# EAGLE design 09F-01 (EAGLE 6.3)
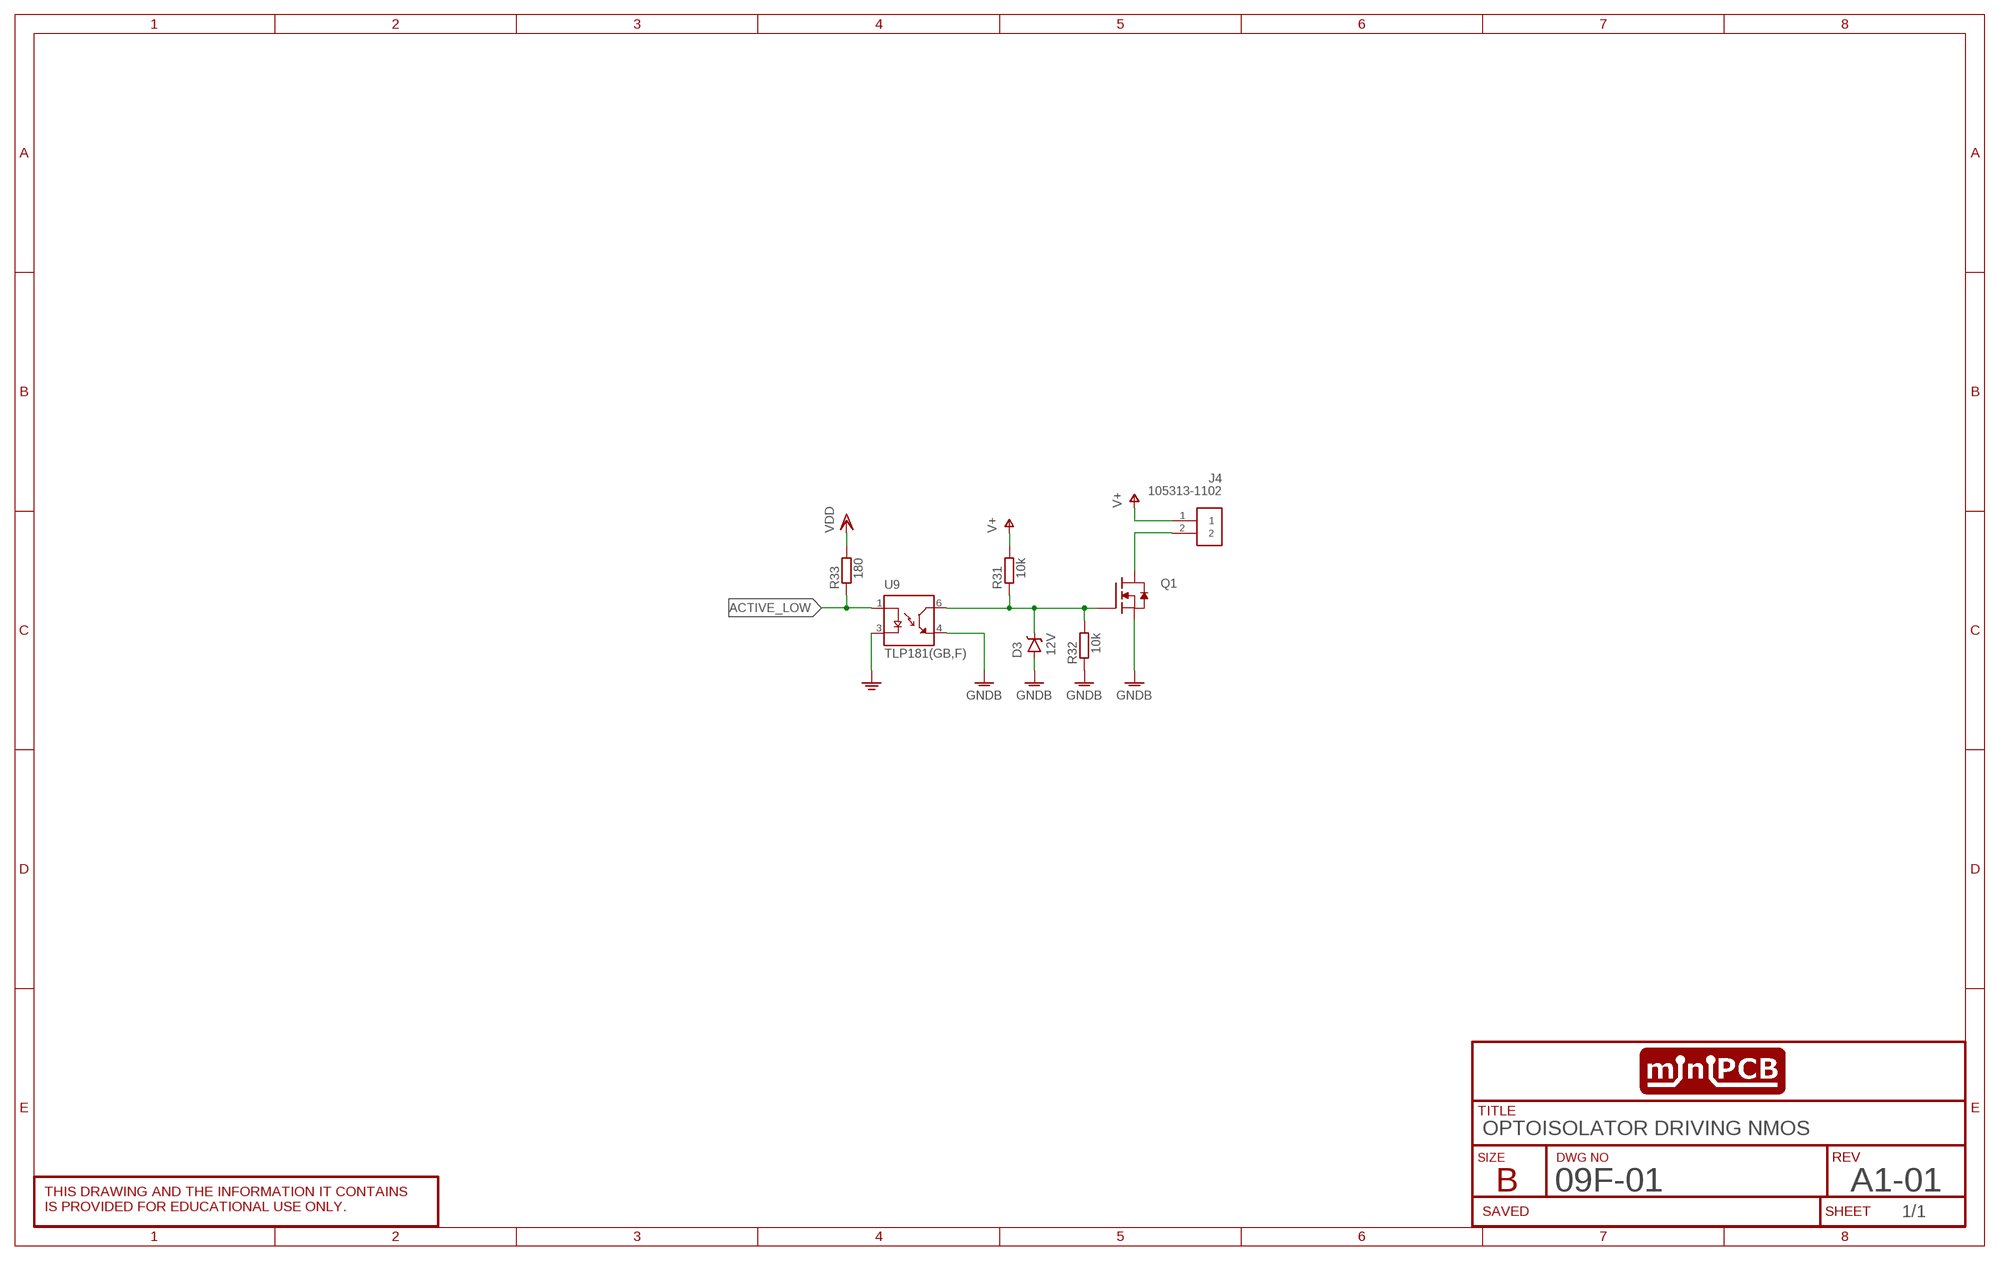
[diagram p0: schematic, sheet 1]
SHEET1 (SCHEMATIC): DWG_NO: 09F-01; REV: A1-01; TITLE: OPTOISOLATOR DRIVING NMOS

## Parts
D3  12V  ZENERSOT23  [SOT23]
J4  105313-1102  PINS_2-NANOFIT-105313-1102  [PINS_2-NANOFIT-H]
Q1  MOSFET-NDPAK  [DPACK]
R31  10k  RESISTORSMD  [R0805]
R32  10k  RESISTORSMD  [R0805]
R33  180  RESISTORSMD  [R0805]
U9  TLP181(GB,F)  [SOIC254P700X280-4N]

## Nets
ACTIVE_LOW: R33.1 U9.1(A)
GND: U9.3(C)
GNDB: D3.1(A) Q1.3(S) R32.1 U9.4(ET)
N$29: D3.3(C) Q1.1(G) R31.1 R32.2 U9.6(CT)
N$31: J4.2 Q1.4(D)
V+: J4.1 R31.2
VDD: R33.2

## Library data of the parts
D3 = minipcb:ZENER: Z-Diode
J4 = utsa:PINS_2
Q1 = minipcb:MOSFET-N
R31-R33 = minipcb:RESISTOR
U9 = minipcb:TLP181(GB,F): Check availability <https://pricing.snapeda.com/parts/TLP181%28GB%2CF%29/Toshiba/view-part?ref=eda>; AVAILABILITY: In Stock; CHECK_PRICES: https://www.snapeda.com/parts/TLP181(GB,F)/Toshiba/view-part/?ref=eda; DESCRIPTION: Optocouplers/Optoisolators, trans, Optoelectronics, optocoupler; MF: Toshiba; MP: TLP181(GB,F); PACKAGE: SO-4 Toshiba; PRICE: None; SNAPEDA_LINK: https://www.snapeda.com/parts/TLP181(GB,F)/Toshiba/view-part/?ref=snap

## Board
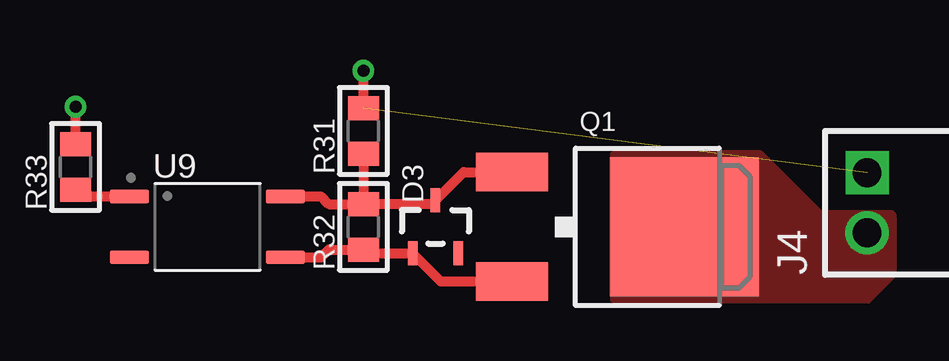
[diagram p1: board, top side]

No outline drawn. Coordinates in mm, seen from the top.
Copper layers (1*16): Top 0.035mm / dielectric 1.5mm / Bottom 0.035mm
Design rules "default": minimum track width 10mil, minimum drill 0.6mm, track to track 8mil, track to pad 8mil, pad to pad 8mil, via to via 8mil, smd to smd 8mil, copper to edge 40mil, drill to drill 8mil, minimum pad ring 10mil, minimum via ring 8mil, stop-mask expansion 4mil, vias tented up to drill 0mil, thermal gap 10mil

### Footprints (pad centres in the part's own frame; a part is rotated, then mirrored left to right if it is on the bottom)
SOT23 = smd 0.4 x 1: 1 -0.95,-1.1; 2 0.95,-1.1; 3 0,1.1
PINS_2-NANOFIT-H = drill 1.2 square: 1 -1.25,0 | drill 1.2: 2 1.25,0 | hole 1.6: 1.27,7.18 | hole 1.75: -1.27,7.18
DPACK = smd 1.6 x 3: 1 -2.28,-4.8; 3 2.28,-4.8 | smd 5.8 x 6.2: 4 0,2.38
R0805 = smd 1 x 1.3: 1 -0.95,0; 2 0.95,0
SOIC254P700X280-4N = smd 1.61 x 0.57: 1 -3.25,1.27; 3 -3.25,-1.27; 4 3.25,-1.27; 6 3.25,1.27

### Placement (x,y rotation side)
D3  -18,-1 0 top
J4  0,0 270 top
Q1  -10,-1 270 top
R31  -21,3 90 top
R32  -21,-1 90 top
R33  -33,1.5 90 top
U9  -27.5,-1 0 top

### Tracks (layer width: path | path; a pad name or v marks a point on that pad's centre or on a via)
ACTIVE_LOW
  Top 0.406: R33.1 -32.72,0.27 U9.1
GNDB
  Top 0.406: U9.4 -22.77,-2.27 -22.45,-1.95 R32.1 -20.85,-2.1 D3.1 -17.77,-3.28 Q1.3
N$29
  Top 0.406: U9.6 -22.77,0.27 -22.45,-0.05 R32.2 | R31.1 R32.2 | R32.2 -18.15,-0.05 D3.3 -16.82,1.28 Q1.1
N$31
  pour Top (no thermals): -2,-0.5 1,-0.5 1,-3 0,-4 -10.5,-4 -10.5,2 -4.5,2
V+  (via drill 0.5)  (1 unrouted)
  Top 0.406: R31.2 v-21,5.5
VDD  (via drill 0.5)
  Top 0.406: R33.2 v-33,4